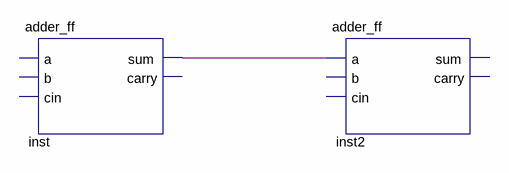
[diagram p0: schematic sheet]
// Quartus schematic schematics.bdf as structural Verilog: 2 symbols, 0 pins
module schematics (
);

  wire inst_sum;

  adder_ff inst (.sum(inst_sum));  // open: a, b, cin, carry
  adder_ff inst2 (.a(inst_sum));  // open: b, cin, sum, carry
endmodule
